# EasyEDA Pro project ProDoc_补光灯V2.0_2025-09-29.epro

# Schematic Schematic7_1
Board Name: 补光灯V2.0; Create Date: 2025-03-30; Page Name: P1; Project Name: 智能车竞赛2025; Schematic Name: Schematic7_1; Update Date: 2025-04-07; Company: 嘉立创EDA; Page Size: A4; Version: V1.0
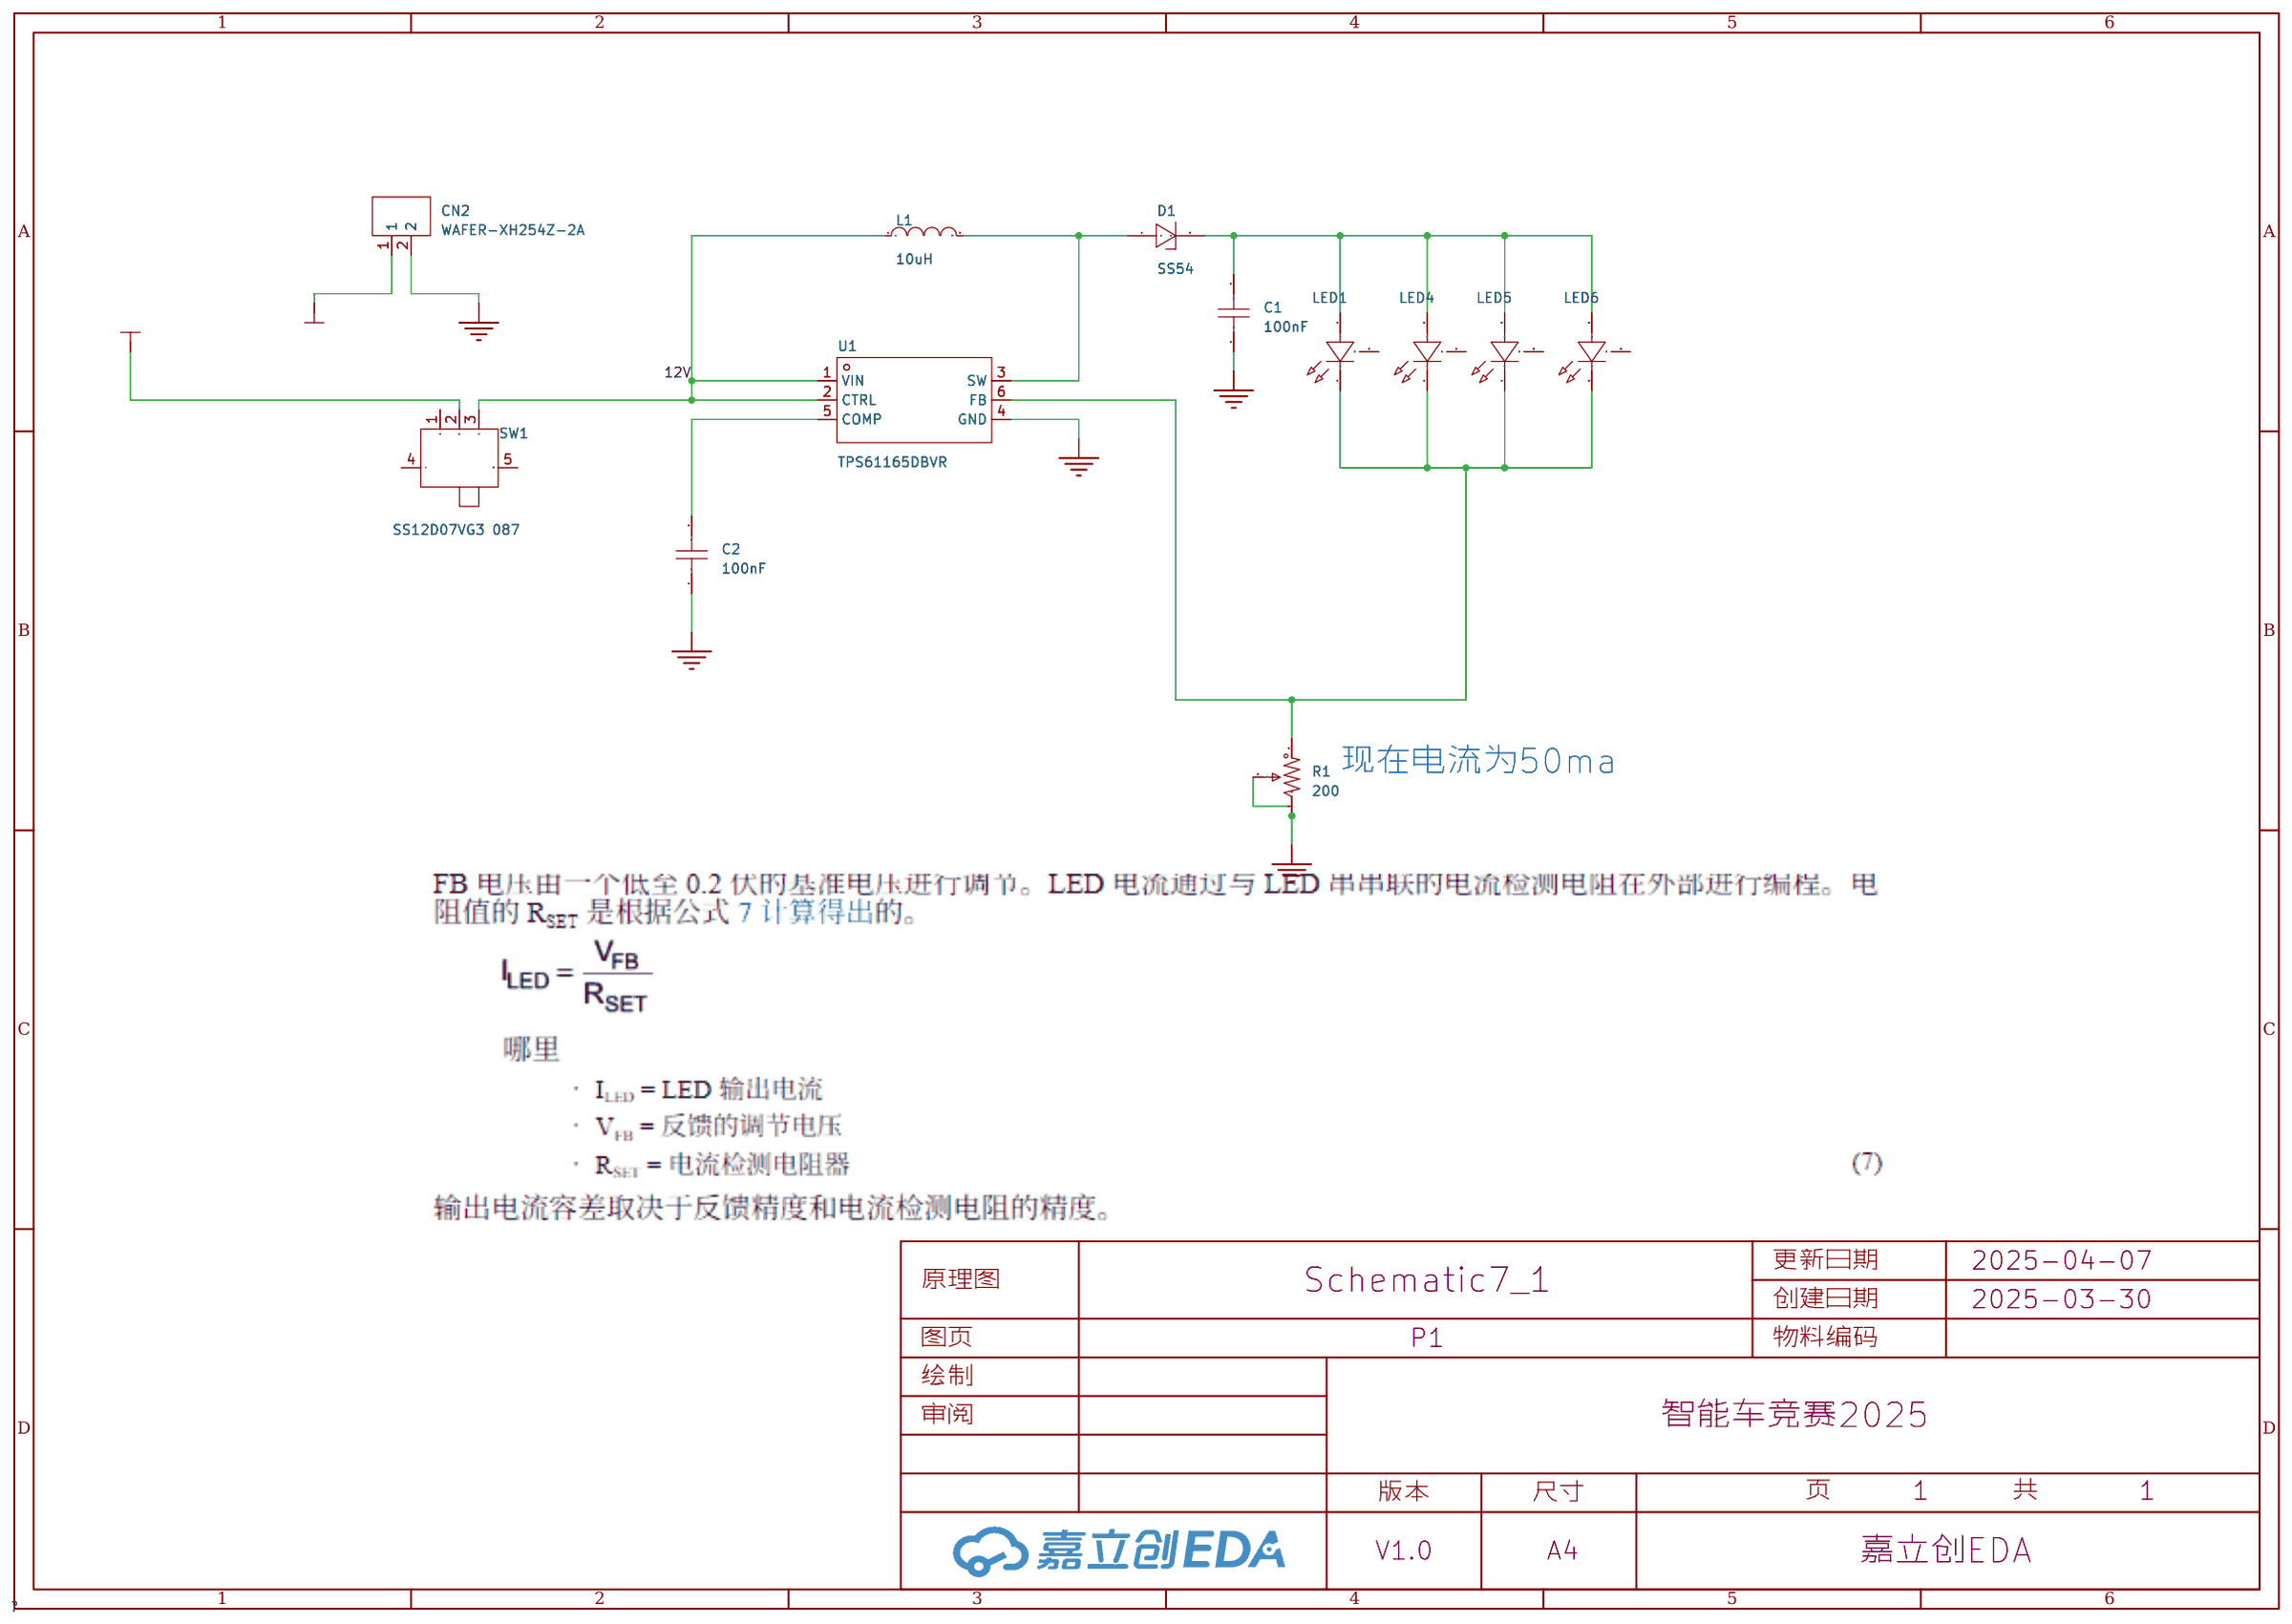
[diagram p0: schematic sheet]

## Parts
C1  100nF  [C1206]
C2  100nF  [C0805]
CN2  WAFER-XH254Z-2A  [CONN-TH_2P-P2.50_XH-2A_3045048]
D1  SS54  [SMA_L4.3-W2.6-LS5.0-FD]
L1  10uH  [IND-SMD_L5.4-W5.2_FXL0530]
LED1  XL-5730UWC-05  [LED-SMD_3P-L5.7-W3.0-RD]
LED4  XL-5730UWC-05  [LED-SMD_3P-L5.7-W3.0-RD]
LED5  XL-5730UWC-05  [LED-SMD_3P-L5.7-W3.0-RD]
LED6  XL-5730UWC-05  [LED-SMD_3P-L5.7-W3.0-RD]
R1  200  [RES-ADJ-TH_3296X]
SW1  SS12D07VG3 087  [SW-TH_SS12D07VG4]
U1  TPS61165DBVR  [SOT-23-6_L2.9-W1.6-P0.95-LS2.8-BR]

## Library data of the parts
C1 = CAP_1206: Supplier Footprint: 1206
C2 = CAP_0805: Supplier Footprint: 0805
CN2 = WAFER-XH254Z-2A: 插针结构:1x2P;间距:2.54mm;安装方式:直插;参考系列:XH;总PIN数:2P;排数:1;每排PIN数:2;额定电流:3A;工作温度范围:-25℃~+85℃;; Supplier Part: C7432682; Manufacturer: HANBO(汉博); Supplier Footprint: 插件,P=2.5mm; JLCPCB Part Class: 扩展库; Datasheet: https://atta.szlcsc.com/upload/public/pdf/source/20230718/3B4FABA5D38EFB02DAF74E7C2B33D98F.pdf; Supplier: LCSC; Pins Structure: 1x2P; Pitch: 2.54mm; Mounting Style: 直插; Reference Series: XH; Number of Pins: 2P; Number of Rows: 1; Number of PINs Per Row: 2; Current Rating (Max): 3A; Operating Temperature Range: -25℃~+85℃
D1 = SS54_C7420369: 二极管配置:独立式;正向压降(Vf):550mV@5.0A;直流反向耐压(Vr):40V;整流电流:5A;; LCSC Part Name: 电压:40V 电流:5A; Supplier Part: C7420369; Manufacturer: 宏迦橙; Supplier Footprint: SMA(DO-214AC); JLCPCB Part Class: 扩展库; Datasheet: https://atta.szlcsc.com/upload/public/pdf/source/20230828/254C3882F8647358AD9F60DD73611B5E.pdf; Supplier: LCSC; Diode Configuration: 独立式; Forward Voltage (Vf@If): 550mV@5.0A; Reverse Voltage (Vr): 40V; Rectified Current: 5A; Reverse Leakage Current (Ir): 50uA@40V
L1 = FXL0530-100-M: 电感值:10uH;精度:±20%;额定电流:3.2A;饱和电流(Isat):3.5A;类型:一体成型电感;; LCSC Part Name: 10uH ±20% 3.5A; Supplier Part: C177248; Manufacturer: cjiang(长江微电); Supplier Footprint: SMD,5.2x5.4mm; JLCPCB Part Class: 扩展库; Datasheet: https://atta.szlcsc.com/upload/public/pdf/source/20230516/4BF6F9C76E81720F52A39ED5FFFA18B4.pdf; Supplier: LCSC; Tolerance: ±20%; Rated Current: 3.2A; Saturation Current (Isat): 3.5A; DC Resistance (DCR): 125mΩ; Type: 一体成型电感
LED1 LED4-LED6 = XL-5730UWC-05: 发光颜色:白色;功率:500mW;正向电流:150mA;透镜颜色:黄色透镜;色温:6000K~6500K;发光角度:120°;载带方式:正贴;工作温度:-30℃~+85℃;; Supplier Part: C2843887; Manufacturer: XINGLIGHT(成兴光); Supplier Footprint: SMD5730; JLCPCB Part Class: 扩展库; Datasheet: https://atta.szlcsc.com/upload/public/pdf/source/20221102/E8767F8417912EAAA1891B3E1CB1CE9F.pdf; Supplier: LCSC; Emitted Color: 白色; Power Dissipation: 500mW; Forward Current: 150mA; Lens Color: 黄色透镜; Color Temperature: 6000K~6500K; Viewing Angle: 120°; Mounting Sytle: 正贴; Operating Temperature: -30℃~+85℃
R1 = 3296X-1-502: 阻值:5kΩ;精度:±10%;; LCSC Part Name: 5kΩ ±10%; Supplier Part: C118902; Manufacturer: BOCHEN(博晨); Supplier Footprint: 插件; JLCPCB Part Class: 扩展库; Datasheet: https://atta.szlcsc.com/upload/public/pdf/source/20171114/C118902_15106326536711117392.pdf; Supplier: LCSC; Tolerance: ±10%
SW1 = SS12D07VG3 087: 电路结构:单刀双掷;安装方式:直插;开关颜色:-;额定电流(DC):500mA;额定电压(DC):50V;额定电流(AC):-;额定电压(AC):-;机械寿命:5千次;; Supplier Part: C2939725; Manufacturer: SHOU HAN(首韩); Supplier Footprint: 插件; JLCPCB Part Class: 扩展库; Datasheet: https://atta.szlcsc.com/upload/public/pdf/source/20220106/77EDD450BA7545A1F1665F035F54D3A4.pdf; Supplier: LCSC; Circuit: 单刀双掷; Pin Style: PC引脚; Switch Length: 8.7mm; Switch Width: 4.4mm; Switch Height: 4.7mm; Mounting Style: 直插; Current Rating (DC): 500mA; Voltage Rating (DC): 50V; Mechanical Life: 5千次; Operating Temperature: -10℃~+50℃
U1 = TPS61165DBVR: 类型:DC-DC稳压器;输入电压:3V~18V;开关频率:1.2MHz;通道数:1;输出电压:3V~38V;输出电流:1.2A;调光:PWM;拓扑结构:升压;; Supplier Part: C58756; Manufacturer: TI(德州仪器); Supplier Footprint: SOT-23-6; JLCPCB Part Class: 扩展库; Datasheet: https://www.ti.com/cn/lit/gpn/tps61165; Supplier: LCSC; Type: DC-DC稳压器; Input Voltage: 3V~18V; Switch Frequency: 1.2MHz; Channels: 1; Output Voltage: 3V~38V; Output Current: 1.2A; Dimming: PWM; Topology: 升压; Operating temperature: -40℃~+85℃

## Nets
12V: L1.1 SW1.3 U1.1(VIN) U1.2(CTRL)
GND: C1.1 C2.1 CN2.2 R1.2 R1.3 U1.4(GND)
VIN: CN2.1 SW1.2
$1N283: D1.1(A) L1.2 U1.3(SW)
$1N488: C1.2 D1.2(K) LED1.2(A) LED4.2(A) LED5.2(A) LED6.2(A)
$1N821: LED1.1(K) LED4.1(K) LED5.1(K) LED6.1(K) R1.1 U1.6(FB)
$1N3212: C2.2 U1.5(COMP)

Not connected (* = marked no-connect by the designer): LED1 3; LED4 3; LED5 3; LED6 3; SW1 1 4 5

## Notes on the sheet
- 现在电流为50ma

# Board PCB21_1
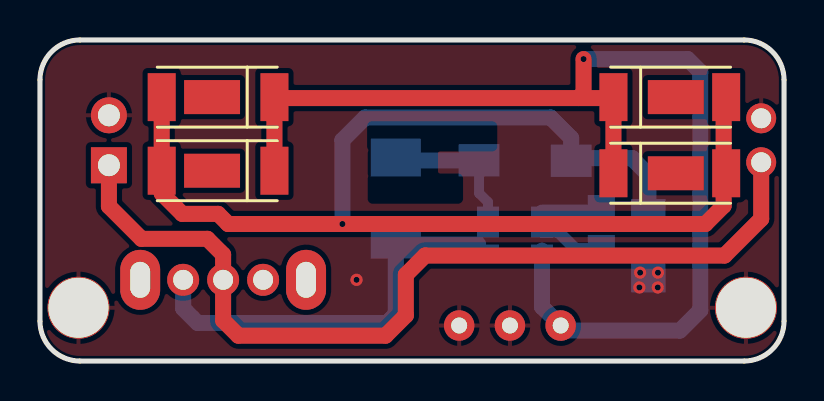
[diagram p1: board, top side]
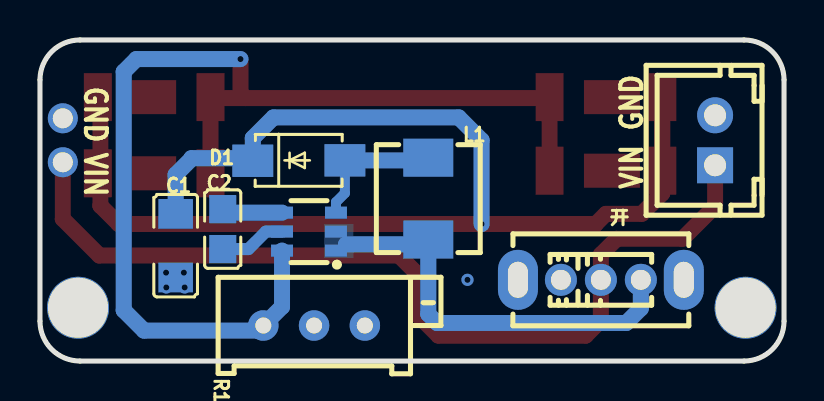
[diagram p2: board, bottom side, seen from below]

Outline 37.23 x 16.07 mm; copper layers: Top Layer, Bottom Layer. Coordinates in mm from the lower left corner of the outline.
Outline path: 0,14.07 0,2 arc(0.59,0.59) 2,0 35.23,0 arc(36.65,0.59) 37.23,2 37.23,14.07 arc(36.65,15.48) 35.23,16.07 2,16.07 arc(0.59,15.48) 0,14.07
Stack: Top Layer 0.035mm / Dielectric1 1.51mm FR4 er 4.5 / Bottom Layer 0.035mm

## Design rules (mm)
template: JLCPCB Capability(Two Layers Board)
spacing copperThickness1oz (default): track to track 0.102, other pairs 0.152 to 0.3
spacing copperThickness2oz: track to track 0.203, other pairs 0.152 to 0.3
track width copperThickness1oz (default): min 0.127, default 0.254, max 2.54
track width copperThickness2oz: min 0.203, default 0.254, max 2.54
differential pair differentialPair (default): width min 0.127, default 0.254, max 2.54; gap min 0.152, default 0.152
via viaSize (default): diameter min 0.5, default 0.61, max 10; hole min 0.3, default 0.305, max 6.3

## Placement (name value [footprint] x y rotation side)
C1  100nF  [C1206]  30.44 5.77 90 bottom
C2  100nF  [C0805]  28.09 6.6 270 bottom
CN2  WAFER-XH254Z-2A  [CONN-TH_2P-P2.50_XH-2A_3045048]  3.45 11.05 90 bottom
D1  SS54  [SMA_L4.3-W2.6-LS5.0-FD]  24.28 10.03 0 bottom
L1  10uH  [IND-SMD_L5.4-W5.2_FXL0530]  17.8 8.13 90 bottom
LED1  XL-5730UWC-05  [LED-SMD_3P-L5.7-W3.0-RD]  8.91 9.53 180 top
LED4  XL-5730UWC-05  [LED-SMD_3P-L5.7-W3.0-RD]  8.91 13.21 180 top
LED5  XL-5730UWC-05  [LED-SMD_3P-L5.7-W3.0-RD]  31.52 9.4 0 top
LED6  XL-5730UWC-05  [LED-SMD_3P-L5.7-W3.0-RD]  31.52 13.21 0 top
NOREF  -  [Pad_e196]  1.93 2.67 0 top
NOREF#2  -  [Pad_e488]  36.09 9.95 0 top
NOREF#3  -  [Pad_e207]  35.33 2.67 0 top
NOREF#4  -  [Pad_e503]  36.09 12.15 0 top
R1  200  [RES-ADJ-TH_3296X]  23.52 1.78 90 bottom
U1  TPS61165DBVR  [SOT-23-6_L2.9-W1.6-P0.95-LS2.8-BR]  23.77 6.48 180 bottom
开  SS12D07VG3 087  [SW-TH_SS12D07VG4]  9.16 4.06 180 bottom

## Footprints (pads in the part's own frame, mm; a bottom-side part is the same pattern mirrored in y, then rotated)
C0805
  rect 1.41x1.35 smd: 1(-1,0) 2(1,0)
C1206
  rect 1.485x1.728 smd: 1(-1.593,0) 2(1.593,0)
CONN-TH_2P-P2.50_XH-2A_3045048
  rect 1.8x1.8 hole 1.1: 1(-1.25,0)
  round 1.8 hole 1.1: 2(1.25,0)
IND-SMD_L5.4-W5.2_FXL0530
  rect 1.9x2.5 smd: 1(-2.05,0) 2(2.05,0)
LED-SMD_3P-L5.7-W3.0-RD
  rect 1.4x2.4 smd: 1(-2.82,0) 2(2.82,0)
  rect 2.8x1.7 smd: 3(0.3,0)
Pad_e196
  round 3.1 hole 3: 1(0,0)
Pad_e207
  round 3.1 hole 3: 1(0,0)
Pad_e488
  round 1.5 hole 1: 1(0,0)
Pad_e503
  round 1.5 hole 1: 1(0,0)
RES-ADJ-TH_3296X
  round 1.524 hole 0.8: 1(0,2.54) 2(0,0) 3(0,-2.54)
SMA_L4.3-W2.6-LS5.0-FD
  rect 2.046x1.62 smd: 1(-2.304,-0.009) 2(2.304,0.009)
SOT-23-6_L2.9-W1.6-P0.95-LS2.8-BR
  rect 1.1x0.6 smd: 1(1.35,-0.95) 2(1.35,0) 3(1.35,0.95) 4(-1.35,0.95) 5(-1.35,0) 6(-1.35,-0.95)
SW-TH_SS12D07VG4
  oval 1.6x1.6 hole 1: 1(-2,0) 2(0,0) 3(2,0)
  oval 2x3 hole 1x1.8: 4(4.15,0) 5(-4.15,0)

## Nets
12V: L1.1 U1.1 U1.2 开.3
GND: C1.1 C2.1 CN2.2 NOREF.1 NOREF#3.1 NOREF#4.1 R1.2 R1.3 U1.4
VIN: CN2.1 NOREF#2.1 开.2
$1N283: D1.1 L1.2 U1.3
$1N488: C1.2 D1.2 LED1.2 LED4.2 LED5.2 LED6.2
$1N821: LED1.1 LED4.1 LED5.1 LED6.1 R1.1 U1.6
$1N3212: C2.2 U1.5

Pads without a net: LED1 3; LED4 3; LED5 3; LED6 3; 开 1 4 5

## Via types
v1: diameter 0.61, hole 0.305, Top Layer to Bottom Layer, 7 vias

## Routing (per net, layer and track width the routed paths; a pad name or vN(x,y) marks a point on that pad's centre or on a via; arc(x,y) is an arc through that point)
12V: length 19.4
  Bottom Layer w0.8: 21.93,5.84 17.8,5.84 17.8,2.35 17.36,1.91 7.89,1.91 7.16,2.64 7.16,3.3
GND: length 3
  Bottom Layer w0.8: U1.4 27.91,7.43 C2.1
  vias: v1(15.84,4.06) v1(30.03,4.42) v1(29.99,3.68) v1(30.92,4.42) v1(30.91,3.68)
VIN: length 45.5
  Top Layer w0.8: 36.09,9.65 36.09,7.11 34.26,5.28 19.27,5.28 18.31,4.32 18.31,2.29 17.29,1.27 9.93,1.27 9.16,2.03 开.2 9.16,5.33 8.38,6.12 5.08,6.12 3.45,7.75 CN2.1
$1N283: length 7
  Bottom Layer w0.5: D1.1 21.97,8.4 22.42,7.95 U1.3
  Bottom Layer w0.8: L1.2 17.94,10.04 D1.1
$1N488: length 63.3
  Top Layer w0.8: 34.21,13.08 34.21,7.77 33.29,6.86 v1(15.13,6.86) 9.42,6.86 8.91,7.37 7.12,7.37 6.09,8.39 LED1.2 LED4.2
  Bottom Layer w0.8: v1(15.13,6.86) 15.13,11.05 16.28,12.19 25.55,12.19 26.58,11.16 D1.2 26.58,9.9 26.84,10.15 29.65,10.15 29.65,10.12 30.44,9.33 C1.2
$1N821: length 56.2
  Top Layer w0.8: LED1.1 LED4.1 11.78,13.16 26.94,13.16 ; 26.94,13.16 27.2,13.42 v1(27.2,15.11) ; 26.94,13.16 28.65,13.16 LED6.1 LED5.1
  Bottom Layer w0.8: U1.6 25.12,2.71 26.31,1.52 32.02,1.52 33.04,2.54 33.04,14.48 32.41,15.11 v1(27.2,15.11)
$1N3212: length 3.3
  Bottom Layer w0.6: C2.2 26.8,5.6 25.93,6.48 U1.5

## Copper pours and planes (outline as drawn; the poured copper is in the pictures)
12V on Bottom Layer: 21.55,6.86 23.01,6.86 23.01,5.15 21.55,5.15
GND on Top Layer: -1.25,20.32 38.5,20.32 38.5,-3.68 -1.25,-3.68

## Text on the board
Bottom Silkscreen Layer: VIN | GND
